# EAGLE design 1tda2030b (EAGLE 7.5.0)
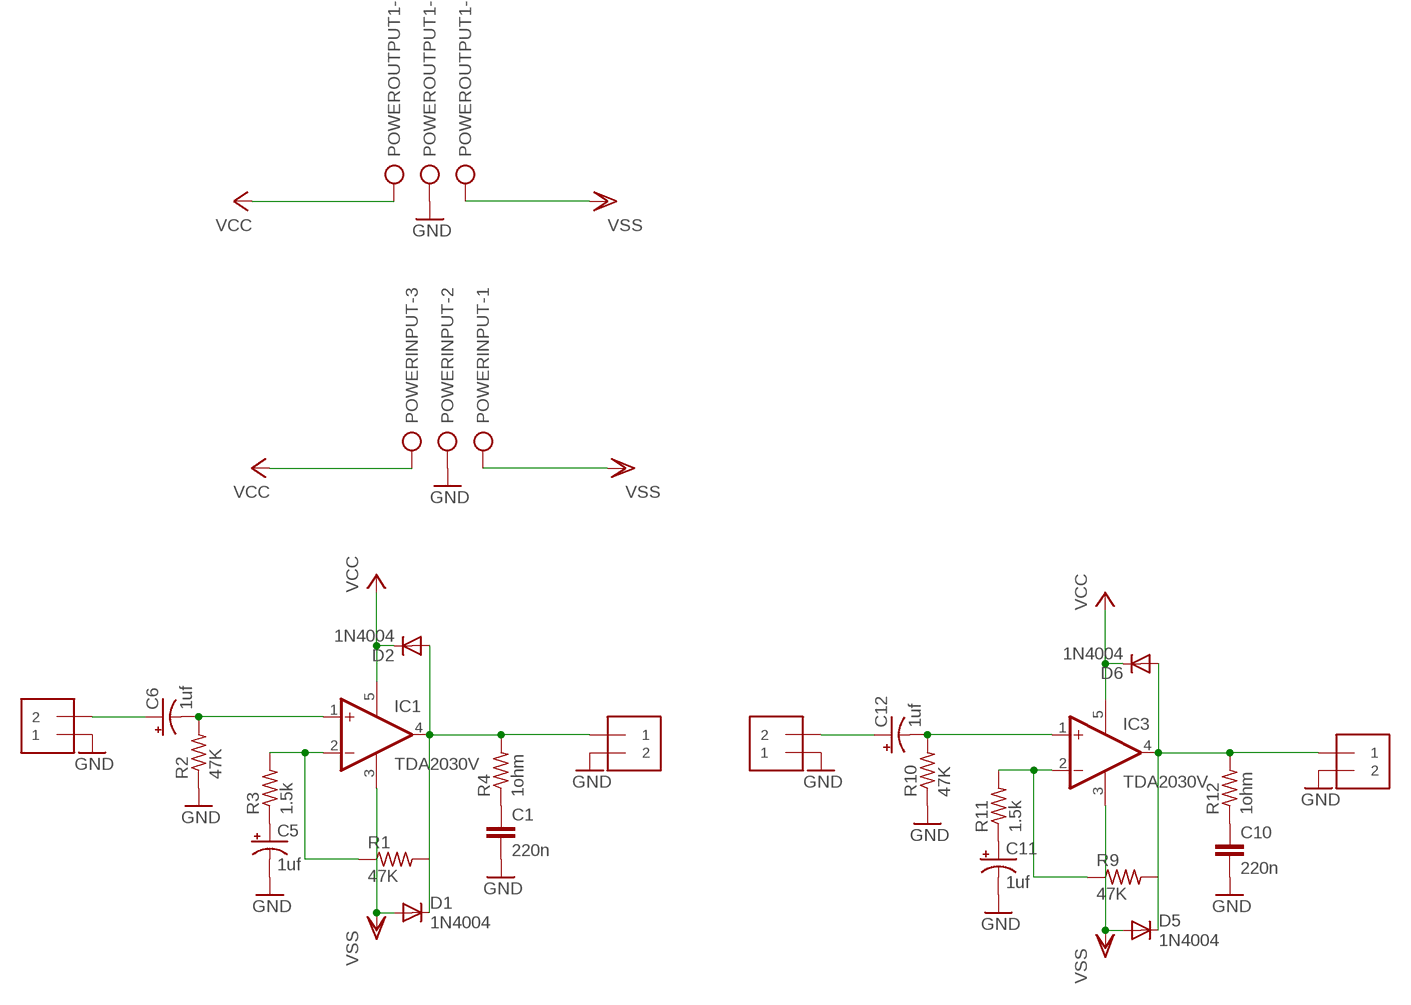
[diagram p0: schematic, sheet 1]

## Parts
1STI/P  1X2-3.5MM  [1X2-3.5MM]
1STO/P  1X2-3.5MM  [1X2-3.5MM]
2NDI/P  1X2-3.5MM  [1X2-3.5MM]
2NDO/P  1X2-3.5MM  [1X2-3.5MM]
C1  220n  0.1UF-KIT-EZ-50V-20%  [CAP-PTH-SMALL-KIT]
C5  1uf  CPOL-USE5-8.5  [E5-8,5]
C6  1uf  CPOL-USE5-8.5  [E5-8,5]
C10  220n  0.1UF-KIT-EZ-50V-20%  [CAP-PTH-SMALL-KIT]
C11  1uf  CPOL-USE5-8.5  [E5-8,5]
C12  1uf  CPOL-USE5-8.5  [E5-8,5]
D1  1N4004  [DO41-10]
D2  1N4004  [DO41-10]
D5  1N4004  [DO41-10]
D6  1N4004  [DO41-10]
IC1  TDA2030V  [CB360]
IC3  TDA2030V  [CB360]
POWERINPUT  AK300/3  [AK300/3]
POWEROUTPUT1  AK300/3  [AK300/3]
R1  47K  FLIPFLOP-RES  [0805-THM]
R2  47K  FLIPFLOP-RES  [0805-THM]
R3  1.5k  FLIPFLOP-RES  [0805-THM]
R4  1ohm  FLIPFLOP-RES  [0805-THM]
R9  47K  FLIPFLOP-RES  [0805-THM]
R10  47K  FLIPFLOP-RES  [0805-THM]
R11  1.5k  FLIPFLOP-RES  [0805-THM]
R12  1ohm  FLIPFLOP-RES  [0805-THM]

## Nets
GND: 1STI/P.1 1STO/P.2 2NDI/P.1 2NDO/P.2 C1.2 C5.- C10.2 C11.- POWERINPUT.2 POWEROUTPUT1.2 R2.1 R10.1
N$1: 1STO/P.1 D1.C D2.A IC1.4(OUT) R1.2 R4.2
N$2: C5.+ R3.1
N$3: IC1.2(-IN) R1.1 R3.2
N$4: C1.1 R4.1
N$5: 1STI/P.2 C6.+
N$6: C6.- IC1.1(+IN) R2.2
N$13: 2NDO/P.1 D5.C D6.A IC3.4(OUT) R9.2 R12.2
N$14: C11.+ R11.1
N$15: IC3.2(-IN) R9.1 R11.2
N$16: C10.1 R12.1
N$17: C12.- IC3.1(+IN) R10.2
N$18: 2NDI/P.2 C12.+
VCC: D2.C D6.C IC1.5(V+) IC3.5(V+) POWERINPUT.3 POWEROUTPUT1.3
VSS: D1.A D5.A IC1.3(GND) IC3.3(GND) POWERINPUT.1 POWEROUTPUT1.1

## Library data of the parts
1STI/P 1STO/P 2NDI/P 2NDO/P = adafruit:1X2: 3.5mm Terminal block http://www.ladyada.net/library/pcb/eaglelibrary.html
C1 C10 = SparkFun-Capacitors:0.1UF: 0.1µF ceramic capacitors A capacitor is a passive two-terminal electrical component used to store electrical energy temporarily in an electric field.; PROD_ID: CAP-08370; VALUE: 0.1uF
C5 C6 C11 C12 = resistor:CPOL-US: POLARIZED CAPACITOR, American symbol
D1 D2 D5 D6 = adafruit:1N4004: DIODE General purpose 1N400x type rectifier (With bigger pads) http://www.ladyada.net/library/pcb/eaglelibrary.html
IC1 IC3 = Audio-Power-amlifier V.2.0:TDA2030: Power OP AMP
POWERINPUT POWEROUTPUT1 = con-ptr500:AK300/3: CONNECTOR; OC_FARNELL: unknown; OC_NEWARK: unknown
R1-R4 R9-R12 = adafruit:FLIPFLOP-RES: Flip Flop resistor An 0805 resistor inside a standard 1/4W 5% resistor. Makes for easy mods

## Board
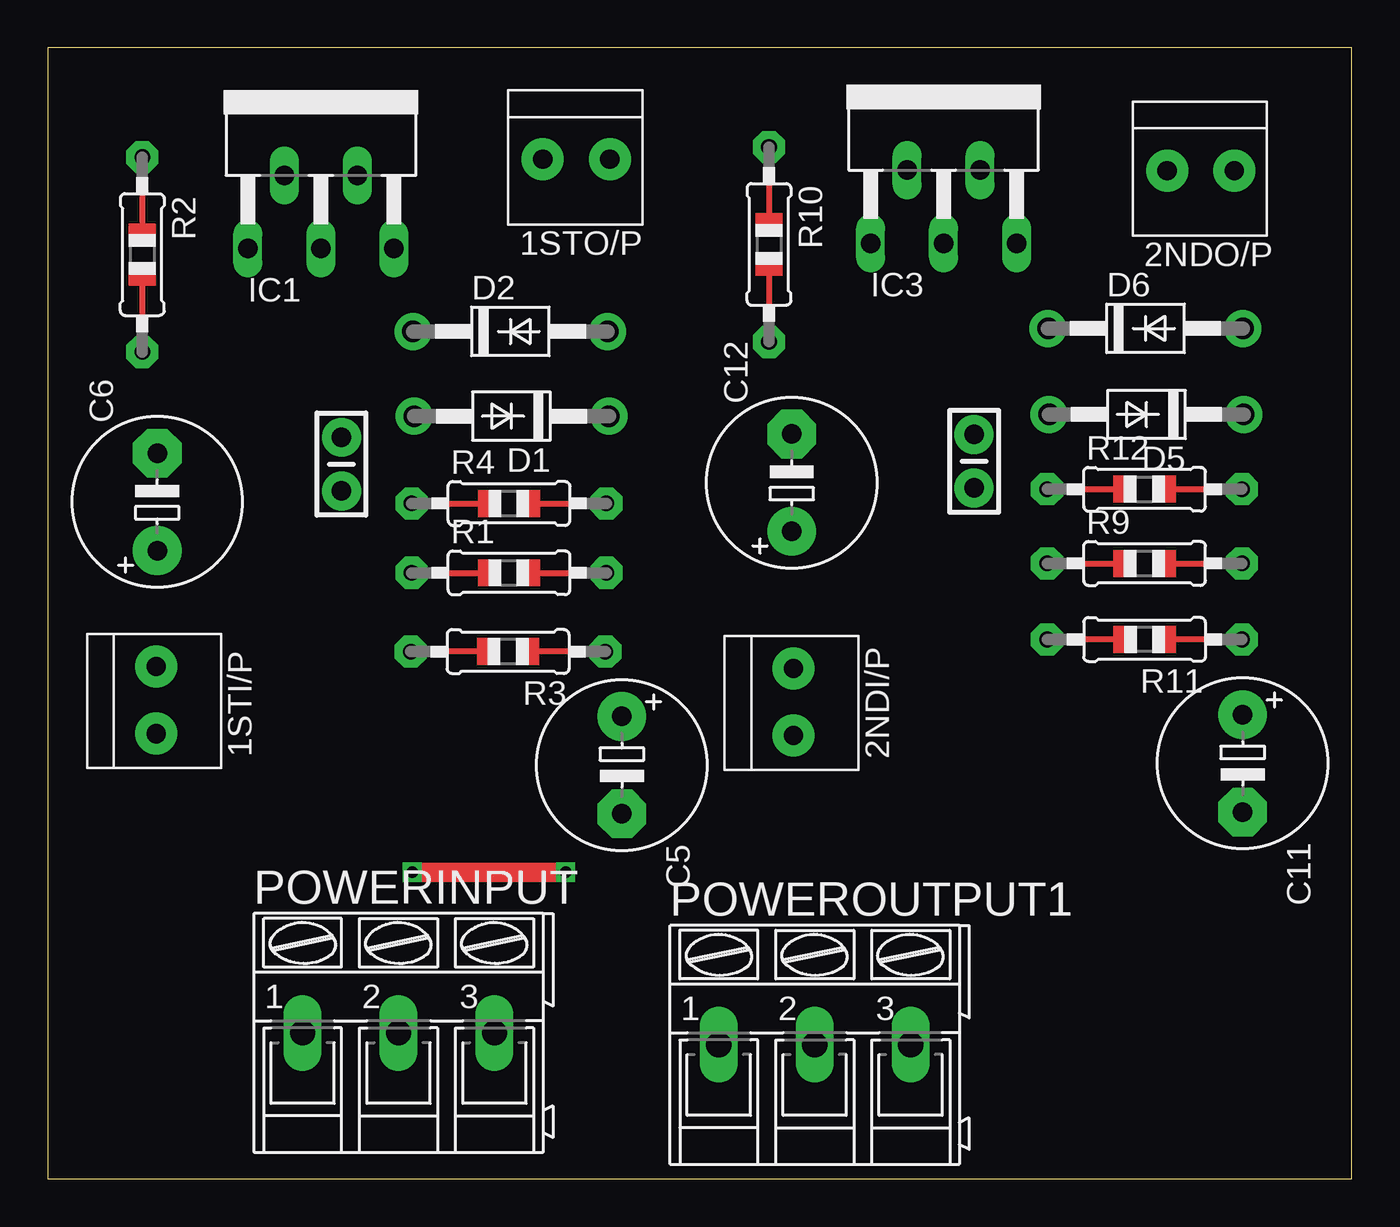
[diagram p1: board, top side]
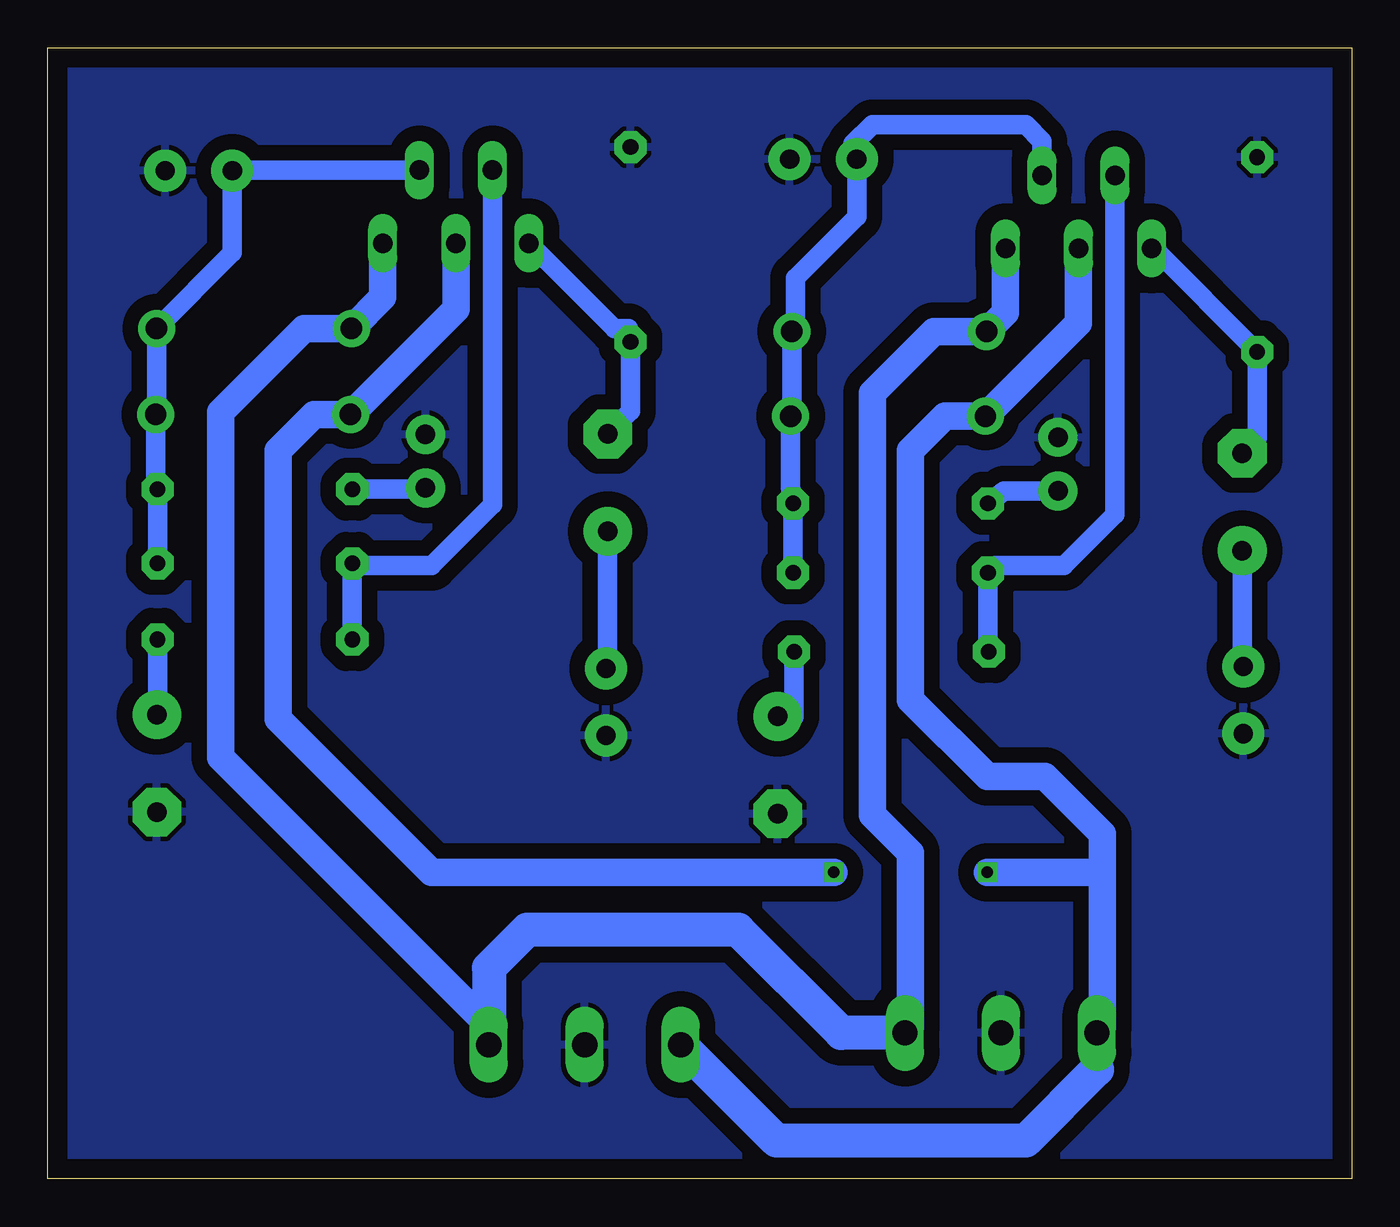
[diagram p2: board, bottom side, seen from below]

Size 68 x 59 mm. Coordinates in mm from the lower left corner, seen from the top.
Outline: 0,0 68,0 68,59 0,59 0,0
Copper layers (1*16): Top 0.035mm / dielectric 1.5mm / Bottom 0.035mm
Design rules "default": minimum track width 10mil, minimum drill 24mil, track to track 8mil, track to pad 8mil, pad to pad 8mil, via to via 8mil, smd to smd 8mil, copper to edge 40mil, drill to drill 8mil, minimum pad ring 10mil, minimum via ring 8mil, stop-mask expansion 4mil, vias tented up to drill 0mil, thermal gap 10mil

### Footprints (pad centres in the part's own frame; a part is rotated, then mirrored left to right if it is on the bottom)
1X2-3.5MM = drill 1 pad 2.184: 1 1.8,0; 2 -1.7,0
CAP-PTH-SMALL-KIT = drill 1.016 pad 2.032: 1 -1.397,0; 2 1.397,0
E5-8,5 = drill 1.016 pad 2.54: + -2.54,0 | drill 1.016 pad 2.54 octagon: - 2.54,0
DO41-10 = drill 1.118 pad 1.93: A 5.08,0; C -5.08,0
CB360 = drill 1.016 long: 1 -3.81,-8.255; 2 -1.905,-4.445; 3 0,-8.255; 4 1.905,-4.445; 5 3.81,-8.255
AK300/3 = drill 1.321 long: 1 -5.004,0; 2 0,0; 3 5.004,0
0805-THM = drill 0.813 pad 1.676 octagon: 1 -5.08,0; 2 5.08,0

### Placement (x,y rotation side)
1STI/P  5.64,25.03 270 top
1STO/P  27.61,53.19 180 top
2NDI/P  38.89,24.93 270 top
2NDO/P  60.18,52.6 180 top
C1  15.31,37.29 90 top
C5  29.94,21.59 270 top
C6  5.7,35.32 90 top
C10  48.31,37.44 90 top
C11  62.32,21.68 270 top
C12  38.8,36.32 90 top
D1  24.18,39.79 180 top
D2  24.12,44.21 0 top
D5  57.3,39.88 180 top
D6  57.25,44.37 0 top
IC1  14.24,56.8 0 top
IC3  46.72,57.07 0 top
POWERINPUT  18.29,7.62 0 top
POWEROUTPUT1  40,7 0 top
R1  24.05,31.62 0 top
R2  4.92,48.22 270 top
R3  24,27.51 180 top
R4  24.05,35.24 0 top
R9  57.2,32.11 0 top
R10  37.61,48.75 270 top
R11  57.2,28.14 180 top
R12  57.2,35.98 0 top

### Tracks (layer width: path | path; a pad name or v marks a point on that pad's centre or on a via)
GND
  pour Bottom (isolate 0.813): 0,59.33 0,0 67.02,0 67.02,59.33
N$1
  Bottom 1.016: R1.2 R4.2 29.26,36.12 D1.C 29.2,39.85 D2.A 29,44.41 29,47 25.81,50.19 1STO/P.1 26,53.38 26,54 25,55 17,55 16.14,54.15 IC1.4
N$2
  Bottom 1.016: R3.1 29.08,24.11 C5.+
N$3
  Bottom 1.016: IC1.2 12.34,34.66 15,32 18.59,32 R1.1 18.97,27.56 R3.2
N$4
  Bottom 1.016: C1.1 18.12,35.89 R4.1
N$5
  Bottom 1.016: C6.+ 5.7,26.79 1STI/P.2
N$6
  Bottom 1.016: IC1.1 10.32,48.55 R2.2 4.92,38.64 C6.-
N$13
  Bottom 1.016: IC3.4 58.35,52.62 2NDO/P.1 58.38,48.32 D6.A 62.33,39.93 D5.C 62.38,36.08 R12.2 R9.2
N$14
  Bottom 1.016: R11.1 62.28,24.74 C11.+
N$15
  Bottom 1.016: IC3.2 44.81,35.19 48,32 52.01,32 R9.1 R11.2
N$16
  Bottom 1.016: R12.1 48.37,35.98 C10.1
N$17
  Bottom 0.254: 37.72,44.35 37.72,43.89 R10.2
  Bottom 1.016: R10.2 37.61,40.05 C12.- | 37.72,44.35 38.44,44.35 IC3.1
N$18
  Bottom 1.016: C12.+ 38.8,26.72 2NDI/P.2
VCC
  Bottom 1.422: IC1.5 18.05,45.2 D2.C 21.79,44.21 25,41 25,19 23,17 23,7.91 POWERINPUT.3 | IC3.5 50.53,46.01 D6.C 54.63,44.37 59,40 59,22 45,8
  Bottom 1.778: POWERINPUT.3 26.62,7.62 32,13 43,13 45,11 45,8 POWEROUTPUT1.3
VSS  (via drill 0.6)
  Top 1.016: v27,16 v19,16
  Bottom 1.422: IC1.3 14.24,44.65 D1.A 21.21,39.79 23,38 23,25 19,21 16,21 13,18 13,16 | IC3.3 46.72,45.38 D5.A 54.12,39.88 56,38 56,24 48,16 v27,16 | 13,16 13,7.91 POWERINPUT.1 13.29,5.71 | v19,16 13,16
  Bottom 1.778: 13.29,5.71 17,2 30,2 POWEROUTPUT1.1